# Altium schematic sheet M-LVDS PHY.SchDoc: AMC FMC Carrier v4.0.5
size 420 x 297 mm; CompanyName: WUT; Organization: WUT ISE; Address1: Warsaw University of Technology; Address2: Nowowiejska 15/19 00-665 Warsaw; Address3: t.przywozki@gmail.com; Revision: 1; SheetNumber: 21; SheetTotal: 29; Project: AMC FMC Carrier v4.0.5; ModifiedBy: F. Świtakowski; CheckedDate: -; Title2: M-LVDS PHY; DivGrp: ISE; Designer: T. Przywozki; ModifiedDate: -; ProjectName: ADC/DAC MEZZANINE
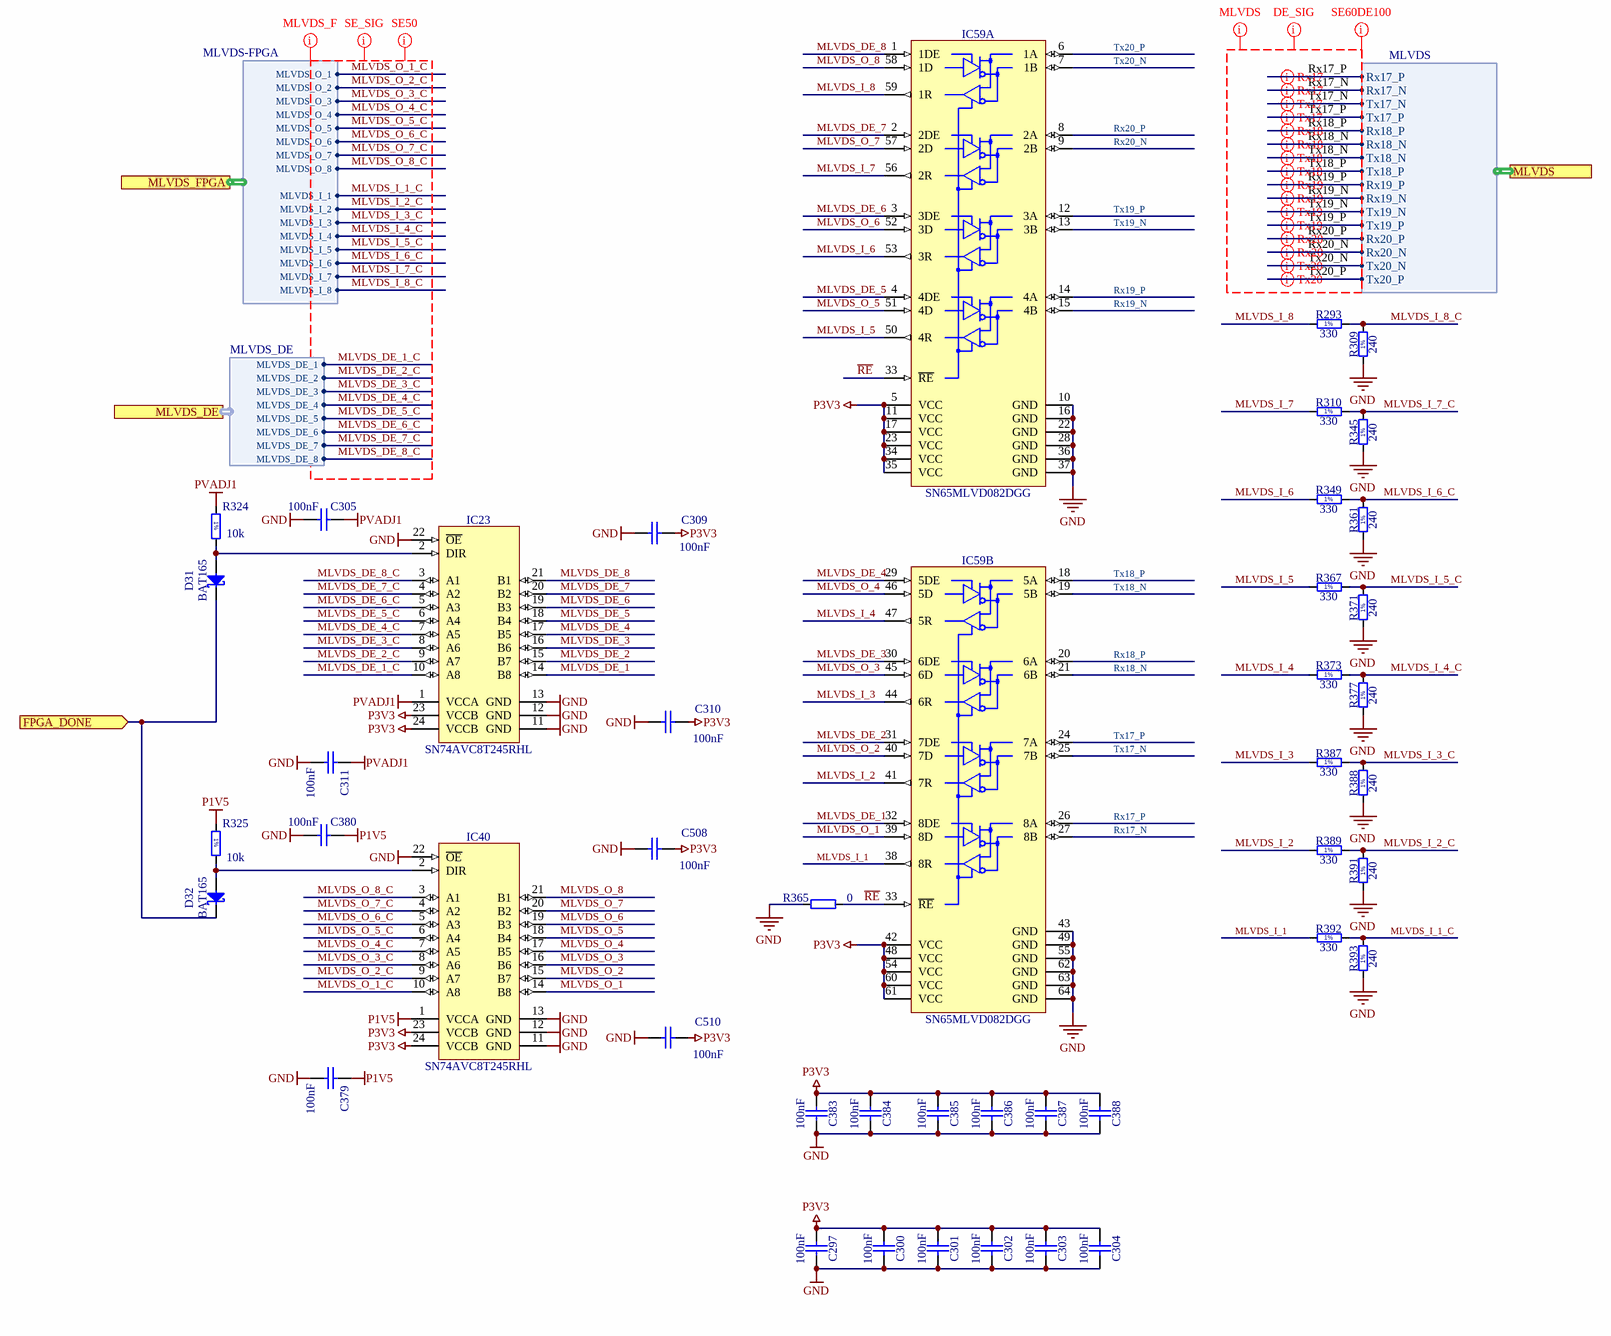
[diagram p0: M-LVDS PHY.SchDoc]

## Parts
C297  100nF  [CAPC0603X33N]
C300  100nF  [CAPC0603X33N]
C301  100nF  [CAPC0603X33N]
C302  100nF  [CAPC0603X33N]
C303  100nF  [CAPC0603X33N]
C304  100nF  [CAPC0603X33N]
C305  100nF  [CAPC0603X33N]
C309  100nF  [CAPC0603X33N]
C310  100nF  [CAPC0603X33N]
C311  100nF  [CAPC0603X33N]
C379  100nF  [CAPC0603X33N]
C380  100nF  [CAPC0603X33N]
C383  100nF  [CAPC0603X33N]
C384  100nF  [CAPC0603X33N]
C385  100nF  [CAPC0603X33N]
C386  100nF  [CAPC0603X33N]
C387  100nF  [CAPC0603X33N]
C388  100nF  [CAPC0603X33N]
C508  100nF  [CAPC0603X33N]
C510  100nF  [CAPC0603X33N]
D31  BAT165  [SOD2512X110N]
D32  BAT165  [SOD2512X110N]
IC23  SN74AVC8T245RHL  [TEXAS_RHL (S-PVQFN-N24)]
IC40  SN74AVC8T245RHL  [TEXAS_RHL (S-PVQFN-N24)]
IC59  SN65MLVD082DGG  [SOP50P810X120-64N]  (parts A,B of 2)
R293  330  [RESC1005X40N]
R309  240  [RESC1005X40N]
R310  330  [RESC1005X40N]
R324  10k  [RESC1005X40N]
R325  10k  [RESC1005X40N]
R345  240  [RESC1005X40N]
R349  330  [RESC1005X40N]
R361  240  [RESC1005X40N]
R365  0  [RESC0603X28N]
R367  330  [RESC1005X40N]
R371  240  [RESC1005X40N]
R373  330  [RESC1005X40N]
R377  240  [RESC1005X40N]
R387  330  [RESC1005X40N]
R388  240  [RESC1005X40N]
R389  330  [RESC1005X40N]
R391  240  [RESC1005X40N]
R392  330  [RESC1005X40N]
R393  240  [RESC1005X40N]

## Ports
FPGA_DONE (in), MLVDS (harness MLVDS), MLVDS_DE (harness MLVDS_DE), MLVDS_FPGA (harness MLVDS-FPGA)

## Harnesses
MLVDS: Rx17_P, Rx17_N, Tx17_N, Tx17_P, Rx18_P, Rx18_N, Tx18_N, Tx18_P, Rx19_P, Rx19_N, Tx19_N, Tx19_P, Rx20_P, Rx20_N, Tx20_N, Tx20_P
MLVDS-FPGA: MLVDS_O_1, MLVDS_O_2, MLVDS_O_3, MLVDS_O_4, MLVDS_O_5, MLVDS_O_6, MLVDS_O_7, MLVDS_O_8, MLVDS_I_1, MLVDS_I_2, MLVDS_I_3, MLVDS_I_4, MLVDS_I_5, MLVDS_I_6, MLVDS_I_7, MLVDS_I_8
MLVDS_DE: MLVDS_DE_1, MLVDS_DE_2, MLVDS_DE_3, MLVDS_DE_4, MLVDS_DE_5, MLVDS_DE_6, MLVDS_DE_7, MLVDS_DE_8

## Nets
GND: C297.2 C300.2 C301.2 C302.2 C303.2 C304.2 C305.1 C309.2 C310.2 C311.1 C379.1 C380.1 C383.2 C384.2 C385.2 C386.2 C387.2 C388.2 C508.2 C510.2 IC23.11(GND) IC23.12(GND) IC23.13(GND) IC23.22(~{OE}) IC40.11(GND) IC40.12(GND) IC40.13(GND) IC40.22(~{OE}) IC59.10(GND) IC59.16(GND) IC59.22(GND) IC59.28(GND) IC59.36(GND) IC59.37(GND) IC59.43(GND) IC59.49(GND) IC59.55(GND) IC59.62(GND) IC59.63(GND) IC59.64(GND) R309.1 R345.1 R361.1 R365.1 R371.1 R377.1 R388.1 R391.1 R393.1
P1V5: C379.2 C380.2 IC40.1(VCCA) R325.1
P3V3: C297.1 C300.1 C301.1 C302.1 C303.1 C304.1 C309.1 C310.1 C383.1 C384.1 C385.1 C386.1 C387.1 C388.1 C508.1 C510.1 IC23.23(VCCB) IC23.24(VCCB) IC40.23(VCCB) IC40.24(VCCB) IC59.5(VCC) IC59.11(VCC) IC59.17(VCC) IC59.23(VCC) IC59.34(VCC) IC59.35(VCC) IC59.42(VCC) IC59.48(VCC) IC59.54(VCC) IC59.60(VCC) IC59.61(VCC)
PVADJ1: C305.2 C311.2 IC23.1(VCCA) R324.1
FPGA_DONE: D31.1(C) D32.1(C) ; port FPGA_DONE
MLVDS_DE_1: IC23.14(B8) IC59.32(8DE)
MLVDS_DE_1_C: IC23.10(A8) ; port MLVDS_DE.MLVDS_DE_1
MLVDS_DE_2: IC23.15(B7) IC59.31(7DE)
MLVDS_DE_2_C: IC23.9(A7) ; port MLVDS_DE.MLVDS_DE_2
MLVDS_DE_3: IC23.16(B6) IC59.30(6DE)
MLVDS_DE_3_C: IC23.8(A6) ; port MLVDS_DE.MLVDS_DE_3
MLVDS_DE_4: IC23.17(B5) IC59.29(5DE)
MLVDS_DE_4_C: IC23.7(A5) ; port MLVDS_DE.MLVDS_DE_4
MLVDS_DE_5: IC23.18(B4) IC59.4(4DE)
MLVDS_DE_5_C: IC23.6(A4) ; port MLVDS_DE.MLVDS_DE_5
MLVDS_DE_6: IC23.19(B3) IC59.3(3DE)
MLVDS_DE_6_C: IC23.5(A3) ; port MLVDS_DE.MLVDS_DE_6
MLVDS_DE_7: IC23.20(B2) IC59.2(2DE)
MLVDS_DE_7_C: IC23.4(A2) ; port MLVDS_DE.MLVDS_DE_7
MLVDS_DE_8: IC23.21(B1) IC59.1(1DE)
MLVDS_DE_8_C: IC23.3(A1) ; port MLVDS_DE.MLVDS_DE_8
MLVDS_I_1: IC59.38(8R) R392.1
MLVDS_I_1_C: R392.2 R393.2 ; port MLVDS_FPGA.MLVDS_I_1
MLVDS_I_2: IC59.41(7R) R389.1
MLVDS_I_2_C: R389.2 R391.2 ; port MLVDS_FPGA.MLVDS_I_2
MLVDS_I_3: IC59.44(6R) R387.1
MLVDS_I_3_C: R387.2 R388.2 ; port MLVDS_FPGA.MLVDS_I_3
MLVDS_I_4: IC59.47(5R) R373.1
MLVDS_I_4_C: R373.2 R377.2 ; port MLVDS_FPGA.MLVDS_I_4
MLVDS_I_5: IC59.50(4R) R367.1
MLVDS_I_5_C: R367.2 R371.2 ; port MLVDS_FPGA.MLVDS_I_5
MLVDS_I_6: IC59.53(3R) R349.1
MLVDS_I_6_C: R349.2 R361.2 ; port MLVDS_FPGA.MLVDS_I_6
MLVDS_I_7: IC59.56(2R) R310.1
MLVDS_I_7_C: R310.2 R345.2 ; port MLVDS_FPGA.MLVDS_I_7
MLVDS_I_8: IC59.59(1R) R293.1
MLVDS_I_8_C: R293.2 R309.2 ; port MLVDS_FPGA.MLVDS_I_8
MLVDS_O_1: IC40.14(B8) IC59.39(8D)
MLVDS_O_1_C: IC40.10(A8) ; port MLVDS_FPGA.MLVDS_O_1
MLVDS_O_2: IC40.15(B7) IC59.40(7D)
MLVDS_O_2_C: IC40.9(A7) ; port MLVDS_FPGA.MLVDS_O_2
MLVDS_O_3: IC40.16(B6) IC59.45(6D)
MLVDS_O_3_C: IC40.8(A6) ; port MLVDS_FPGA.MLVDS_O_3
MLVDS_O_4: IC40.17(B5) IC59.46(5D)
MLVDS_O_4_C: IC40.7(A5) ; port MLVDS_FPGA.MLVDS_O_4
MLVDS_O_5: IC40.18(B4) IC59.51(4D)
MLVDS_O_5_C: IC40.6(A4) ; port MLVDS_FPGA.MLVDS_O_5
MLVDS_O_6: IC40.19(B3) IC59.52(3D)
MLVDS_O_6_C: IC40.5(A3) ; port MLVDS_FPGA.MLVDS_O_6
MLVDS_O_7: IC40.20(B2) IC59.57(2D)
MLVDS_O_7_C: IC40.4(A2) ; port MLVDS_FPGA.MLVDS_O_7
MLVDS_O_8: IC40.21(B1) IC59.58(1D)
MLVDS_O_8_C: IC40.3(A1) ; port MLVDS_FPGA.MLVDS_O_8
~{RE}: IC59.33(~{RE}) R365.2
Rx17_N: IC59.27(8B) ; port MLVDS.Rx17_N
Rx17_P: IC59.26(8A) ; port MLVDS.Rx17_P
Rx18_N: IC59.21(6B) ; port MLVDS.Rx18_N
Rx18_P: IC59.20(6A) ; port MLVDS.Rx18_P
Rx19_N: IC59.15(4B) ; port MLVDS.Rx19_N
Rx19_P: IC59.14(4A) ; port MLVDS.Rx19_P
Rx20_N: IC59.9(2B) ; port MLVDS.Rx20_N
Rx20_P: IC59.8(2A) ; port MLVDS.Rx20_P
Tx17_N: IC59.25(7B) ; port MLVDS.Tx17_N
Tx17_P: IC59.24(7A) ; port MLVDS.Tx17_P
Tx18_N: IC59.19(5B) ; port MLVDS.Tx18_N
Tx18_P: IC59.18(5A) ; port MLVDS.Tx18_P
Tx19_N: IC59.13(3B) ; port MLVDS.Tx19_N
Tx19_P: IC59.12(3A) ; port MLVDS.Tx19_P
Tx20_N: IC59.7(1B) ; port MLVDS.Tx20_N
Tx20_P: IC59.6(1A) ; port MLVDS.Tx20_P
NetD31_2: D31.2(A) IC23.2(DIR) R324.2
NetD32_2: D32.2(A) IC40.2(DIR) R325.2

## Layout directives
differential pair: Rx17_N, Rx17_P, Rx18_N, Rx18_P, Rx19_N, Rx19_P, Rx20_N, Rx20_P, Tx17_N, Tx17_P, Tx18_N, Tx18_P, Tx19_N, Tx19_P, Tx20_N, Tx20_P
net class MLVDS: Rx17_N, Rx17_P, Rx18_N, Rx18_P, Rx19_N, Rx19_P, Rx20_N, Rx20_P, Tx17_N, Tx17_P, Tx18_N, Tx18_P, Tx19_N, Tx19_P, Tx20_N, Tx20_P
net class DE_SIG: Rx17_N, Rx17_P, Rx18_N, Rx18_P, Rx19_N, Rx19_P, Rx20_N, Rx20_P, Tx17_N, Tx17_P, Tx18_N, Tx18_P, Tx19_N, Tx19_P, Tx20_N, Tx20_P
net class SE60DE100: Rx17_N, Rx17_P, Rx18_N, Rx18_P, Rx19_N, Rx19_P, Rx20_N, Rx20_P, Tx17_N, Tx17_P, Tx18_N, Tx18_P, Tx19_N, Tx19_P, Tx20_N, Tx20_P
net class MLVDS_F: MLVDS_DE_1_C, MLVDS_DE_2_C, MLVDS_DE_3_C, MLVDS_DE_4_C, MLVDS_DE_5_C, MLVDS_DE_6_C, MLVDS_DE_7_C, MLVDS_DE_8_C, MLVDS_I_1_C, MLVDS_I_2_C, MLVDS_I_3_C, MLVDS_I_4_C, MLVDS_I_5_C, MLVDS_I_6_C, MLVDS_I_7_C, MLVDS_I_8_C, MLVDS_O_1_C, MLVDS_O_2_C, MLVDS_O_3_C, MLVDS_O_4_C, MLVDS_O_5_C, MLVDS_O_6_C, MLVDS_O_7_C, MLVDS_O_8_C
net class SE50: MLVDS_DE_1_C, MLVDS_DE_2_C, MLVDS_DE_3_C, MLVDS_DE_4_C, MLVDS_DE_5_C, MLVDS_DE_6_C, MLVDS_DE_7_C, MLVDS_DE_8_C, MLVDS_I_1_C, MLVDS_I_2_C, MLVDS_I_3_C, MLVDS_I_4_C, MLVDS_I_5_C, MLVDS_I_6_C, MLVDS_I_7_C, MLVDS_I_8_C, MLVDS_O_1_C, MLVDS_O_2_C, MLVDS_O_3_C, MLVDS_O_4_C, MLVDS_O_5_C, MLVDS_O_6_C, MLVDS_O_7_C, MLVDS_O_8_C
net class SE_SIG: MLVDS_DE_1_C, MLVDS_DE_2_C, MLVDS_DE_3_C, MLVDS_DE_4_C, MLVDS_DE_5_C, MLVDS_DE_6_C, MLVDS_DE_7_C, MLVDS_DE_8_C, MLVDS_I_1_C, MLVDS_I_2_C, MLVDS_I_3_C, MLVDS_I_4_C, MLVDS_I_5_C, MLVDS_I_6_C, MLVDS_I_7_C, MLVDS_I_8_C, MLVDS_O_1_C, MLVDS_O_2_C, MLVDS_O_3_C, MLVDS_O_4_C, MLVDS_O_5_C, MLVDS_O_6_C, MLVDS_O_7_C, MLVDS_O_8_C

## Notes on the sheet
- Project/Equipment
- Document
- Designer
- Drawn by
- Check.by
- Copyright CNPEM 2013, WUT ISE 2020
  This documentation describes Open Hardware and is licensed under CERN OHL v.1.1. You may redistribute and modify this documentaction under the terms of the CERN OHL v1.1.
  (http://ohwr.org/CERNOHL). This documentation is dristributed WITHOUT ANY EXPRESS OR IMPLIED WARRANTY, INCLUDING OF MERCHANTABLITY, SATISFACTORY QUALITY AND FITNESS FOR A PARTICULAR PURPOSE. Please see the CERN OHL v.1.1 for applicable conditions
- File
- Last Mod.
- Print Date
- Sheet
- Size
- A3
- of
- Rev
- Contact:
- (in symbol R0402_10K_1%_0.0625W_100PPM) 1%
- (in symbol R0402_240R_1%_0.0625W_100PPM) 1%
- (in symbol R0402_330R_1%_0.0625W_100PPM) 1%

## Library data of the parts
C297 C300-C305 C309-C311 C379 C380 C383-C388 C508 C510 = CC0201_100NF_6.3V_10%_X5R: Non-polarised capacitor; Part Description: SMD Multilayer Chip Ceramic Capacitor; Manufacturer: GENERIC; Manufacturer1 Part Number: 02016D104KAT2A; Voltage: 6.3V; TC: X5R; Tolerance: ±10%; Table: Capacitors SMD; Part Number: CC0201_100NF_6.3V_10%_X5R; Component Kind: Standard; Component Type: Standard; Pin Count: 2; Value: 100nF; Status: Not Recommended; Manufacturer Part Number: CC0201_100NF_6.3V_10%_X5R; Case: 0201; Mounted: Yes; Socket: No; SMD: Yes; Manufacturer1 Example: AVX; Manufacturer1 ComponentHeight: 0.33mm; HelpURL: \\cern.ch\dfs\Applications\Altium\Datasheets\CC0201_X5R_AVX.pdf; Author: CERN DEM JLC; CreateDate: 2007-12-03; LatestRevisionDate: 2007-12-03
D31 D32 = BAT165: Schottky Diode; Manufacturer: INFINEON; Part Description: Medium Power AF Schottky Diode; Voltage: 40V; Power: 750mA; PressFit: No; Bonding: No; Manufacturer Part Number: BAT165; PackageDescription: Small Outline Diode (SOD-323), 1.70mm W X 1.25mm L X 1.10mm H body,  IPC Medium Density; Part Number: BAT165; Component Kind: Standard; Component Type: Standard; Device: BAT165; Pin Count: 2; Case: SOD323; Mounted: Yes; Socket: No; SMD: Yes; Sense: No; ComponentHeight: 1.1mm; HelpURL: \\cern.ch\dfs\Applications\Altium\Datasheets\BAT165.pdf; Author: CERN DEM JLC; CreateDate: 12.11.2014; LatestRevisionDate: 12.11.2014
IC23 IC40 = SN74AVC8T245RHL: 8-Bit Dual-Supply Bus Transceiver With Configurable Voltage Translation and 3-State Outputs; Manufacturer: TEXAS INSTRUMENTS; PressFit: No; Bonding: No; Part Number: SN74AVC8T245RHL; Component Kind: Standard; Component Type: Standard; Device: SN74AVC8T245RHL; PackageDescription: TEXAS Case Style RHL (S-PVQFN-N24), QFN, 0.50mm Pitch, Rectangular; 24 Pin, 5.50mm L X 3.50mm W X 1mm H body (w/thermal tab 4.05 X 2.05mm); Part Description: 8-Bit Dual-Supply Bus Transceiver With Configurable Voltage Translation and 3-State Outputs; Manufacturer Part Number: SN74AVC8T245RHL; Pin Count: 25; Case: QFN24; Mounted: Yes; Socket: No; SMD: Yes; Sense: No; ComponentHeight: 1.0mm; Author: CERN DEM MR; HelpURL: \\cern.ch\dfs\Applications\Altium\Datasheets\SN74AVC8T245RHL.pdf; CreateDate: 09.11.2016; LatestRevisionDate: 09.11.2016
IC59 = SN65MLVD082DGG: 8-Channel Half-Duplex M-LVDS Line Transceiver; Manufacturer: TEXAS INSTRUMENTS; PressFit: No; Bonding: No; Part Number: SN65MLVD082DGG; Component Kind: Standard; Component Type: Standard; Device: SN65MLVD082DGG; PackageDescription: SOP, 0.50mm Pitch, 64 Pin, 6.10mm W X 17.0mm L X 1.20mm H body, IPC Medium Density; Part Description: 8-Channel Half-Duplex M-LVDS Line Transceiver; Manufacturer Part Number: SN65MLVD082DGG; Pin Count: 64; Case: TSSOP64; Mounted: Yes; Socket: No; SMD: Yes; Sense: No; ComponentHeight: 1.2mm; Author: CERN DEM BC; HelpURL: \\cern.ch\dfs\Applications\Altium\Datasheets\SN65MLVD082DGG.pdf; CreateDate: 15.07.2020; LatestRevisionDate: 15.07.2020
R293 R310 R349 R367 R373 R387 R389 R392 = R0402_330R_1%_0.0625W_100PPM: Resistor - 1%; Part Description: General Purpose Thick Film Chip Resistor; Manufacturer: GENERIC; Manufacturer1 Part Number: 232270673301L; TC: ±100ppm/°C; Table: Resistors SMD; Part Number: R0402_330R_1%_0.0625W_100PPM; Component Kind: Standard; Component Type: Standard; Pin Count: 2; Value: 330; Status: Not recommended; Power: 0.0625W; Tolerance: ±1%; Manufacturer Part Number: R0402_330R_1%_0.0625W_100PPM; Case: 0402; Mounted: Yes; Socket: No; SMD: Yes; Manufacturer1 Example: YAGEO PHYCOMP; Manufacturer1 ComponentHeight: 0.4mm; HelpURL: \\cern.ch\dfs\Applications\Altium\Datasheets\R0402_Phycomp_RC0402.pdf; Author: CERN DEM JLC; CreateDate: 2007-12-03; LatestRevisionDate: 2012-10-17
R309 R345 R361 R371 R377 R388 R391 R393 = R0402_240R_1%_0.0625W_100PPM: Resistor - 1%; Part Description: General Purpose Thick Film Chip Resistor; Manufacturer: GENERIC; Manufacturer1 Part Number: 232270672401L; TC: ±100ppm/°C; PressFit: No; Part Number: R0402_240R_1%_0.0625W_100PPM; Component Kind: Standard; Component Type: Standard; Pin Count: 2; Value: 240; Status: Not Recommended; Power: 0.0625W; Tolerance: ±1%; Manufacturer Part Number: R0402_240R_1%_0.0625W_100PPM; Case: 0402; Mounted: Yes; Sense: No; Socket: No; SMD: Yes; Manufacturer1 Example: YAGEO PHYCOMP; Manufacturer1 ComponentHeight: 0.4mm; HelpURL: \\cern.ch\dfs\Applications\Altium\Datasheets\R0402_Phycomp_RC0402.pdf; Author: CERN DEM JLC; CreateDate: 03.12.2007; LatestRevisionDate: 17.10.2012
R324 R325 = R0402_10K_1%_0.0625W_100PPM: Resistor - 1%; Part Description: General Purpose Thick Film Chip Resistor; Manufacturer: GENERIC; Manufacturer1 Part Number: 232270671003L; TC: ±100ppm/°C; Table: Resistors SMD; Part Number: R0402_10K_1%_0.0625W_100PPM; Component Kind: Standard; Component Type: Standard; Pin Count: 2; Value: 10k; Status: Not recommended; Power: 0.0625W; Tolerance: ±1%; Manufacturer Part Number: R0402_10K_1%_0.0625W_100PPM; Case: 0402; Mounted: Yes; Socket: No; SMD: Yes; Manufacturer1 Example: YAGEO PHYCOMP; Manufacturer1 ComponentHeight: 0.4mm; HelpURL: \\cern.ch\dfs\Applications\Altium\Datasheets\R0402_Phycomp_RC0402.pdf; Author: CERN DEM JLC; CreateDate: 2007-12-03; LatestRevisionDate: 2012-10-17
R365 = R0201_0R_JUMPER: Resistor; Part Description: 1A (0.05R Max DC Resistance) Zero Ohm Jumper; Manufacturer: GENERIC; Manufacturer1 Part Number: CRCW02010000Z0ED; PressFit: No; Part Number: R0201_0R_JUMPER; Component Kind: Standard; Component Type: Standard; Pin Count: 2; Value: 0; Status: Not Recommended; Manufacturer Part Number: R0201_0R_JUMPER; Case: 0201; Mounted: Yes; Sense: No; Socket: No; SMD: Yes; Manufacturer1 Example: VISHAY; Manufacturer1 ComponentHeight: 0.27mm; HelpURL: \\cern.ch\dfs\Applications\Altium\Datasheets\R0201_VISHAY_CRCW e3.pdf; Author: CERN DEM JLC; CreateDate: 19.11.2014; LatestRevisionDate: 08.01.2015